# Altium project EMFI.PrjPcb
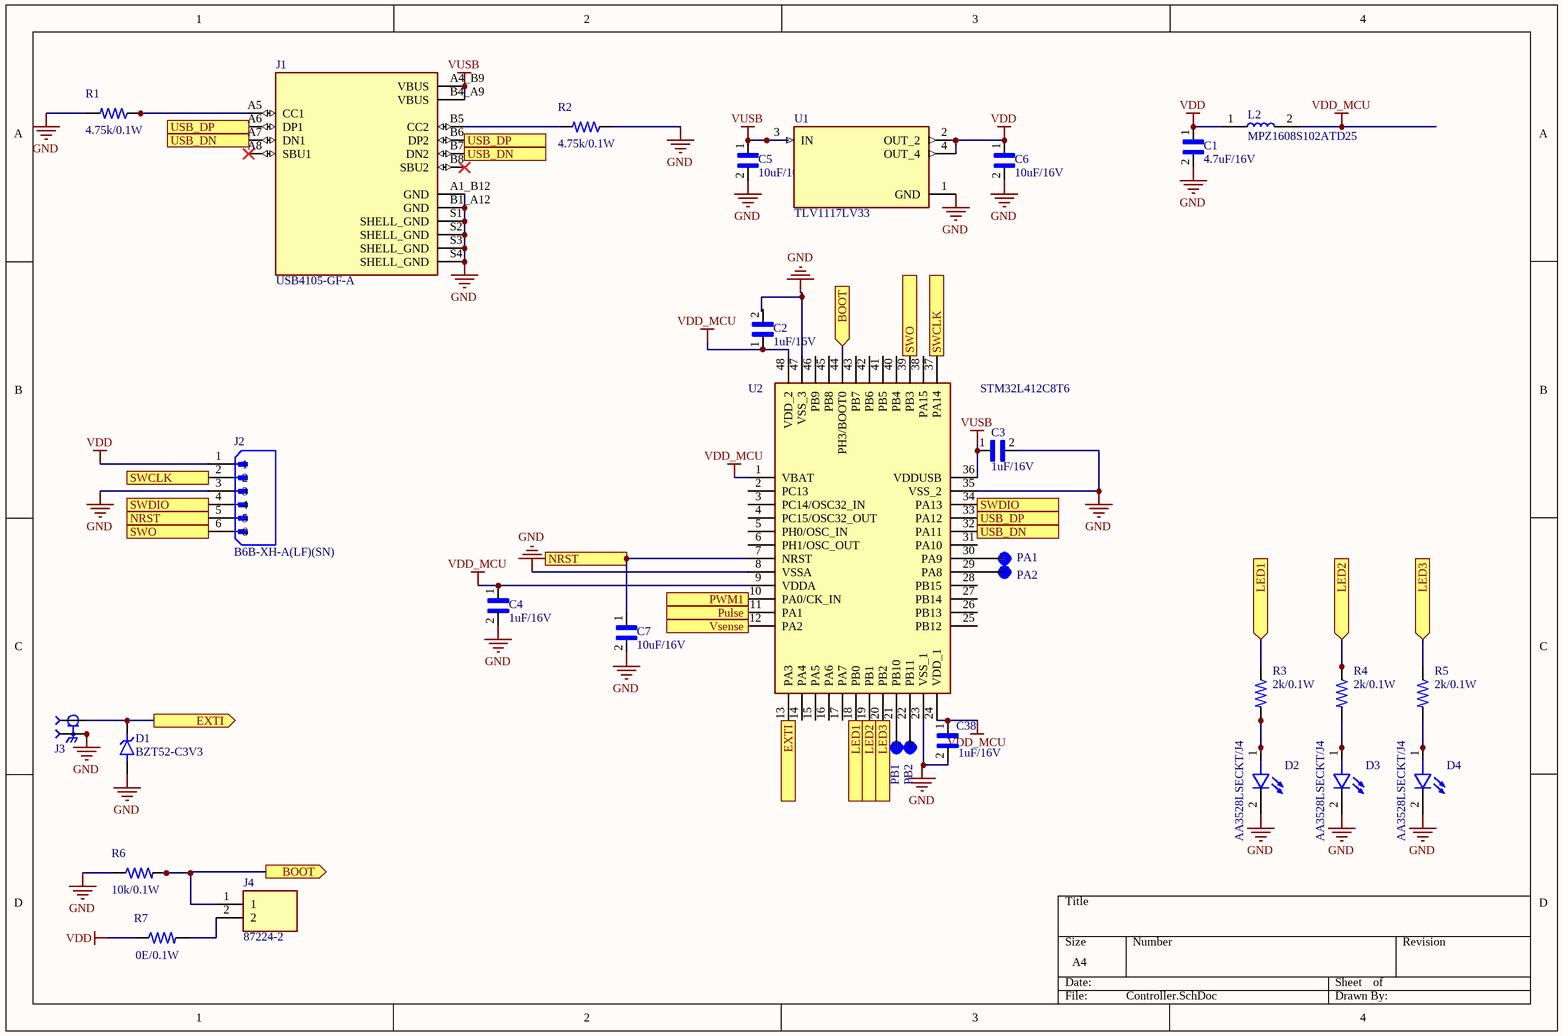
[diagram p0: Controller.SchDoc]
2 sheets, 90 parts. Net scope: flat (ports and power ports of the same name join across sheets).
Board file: EMFI.PcbDoc
Sheets:
  Controller.SchDoc
  Power.SchDoc

## Sheet Controller.SchDoc
size A4; SheetNumber: 1; SheetTotal: 2

### Parts
C1  4.7uF/16V  [CAPC1608X90]
C2  1uF/16V  [CAPC1608X90]
C3  1uF/16V  [CAPC1608X90]
C4  1uF/16V  [CAPC1608X90]
C5  10uF/16V  [CAPC1608X90]
C6  10uF/16V  [CAPC1608X90]
C7  10uF/16V  [CAPC1608X90]
C38  1uF/16V  [CAPC1608X90]
D1  BZT52-C3V3  [SOD3715X145N]
D2  AA3528LSECKT/J4  [LED_OF-SMD3528WC]
D3  AA3528LSECKT/J4  [LED_OF-SMD3528WC]
D4  AA3528LSECKT/J4  [LED_OF-SMD3528WC]
J1  USB4105-GF-A  [GCT_USB4105-GF-A]
J2  B6B-XH-A(LF)(SN)  [JST_B6B-XH-A(LF)(SN)]
J3  SMA-J-P-X-ST-EM3  [SAMTEC_SMA-J-P-X-ST-EM3]  (value not drawn)
J4  87224-2  [TE_87224-2]
L2  MPZ1608S102ATD25  [INDC1608X95N]
PA1  5019  [KEYSTONE_5019]  (value not drawn)
PA2  5019  [KEYSTONE_5019]  (value not drawn)
PB1  5019  [KEYSTONE_5019]  (value not drawn)
PB2  5019  [KEYSTONE_5019]  (value not drawn)
R1  4.75k/0.1W  [RESC1608X50N]
R2  4.75k/0.1W  [RESC1608X50N]
R3  2k/0.1W  [RESC1608X50N]
R4  2k/0.1W  [RESC1608X50N]
R5  2k/0.1W  [RESC1608X50N]
R6  10k/0.1W  [RESC1608X50N]
R7  0E/0.1W  [RESC1608X50N]
U1  TLV1117LV33  [VREG_TLV1117LV33DCYR]
U2  STM32L412C8T6  [QFP50P900X900X160-48N]

### Ports
BOOT (in, see Controller[1D]), BOOT (out, see Controller[3B]), EXTI (in, see Controller[1C], Power[1D]), EXTI (out, see Controller[3D], Power[1D]), LED1 (in, see Controller[3D]), LED1 (out, see Controller[4C]), LED2 (in, see Controller[3D]), LED2 (out, see Controller[4C]), LED3 (in, see Controller[3D]), LED3 (out, see Controller[4C]), NRST (see Controller[1C]), NRST (see Controller[2C]), Pulse (out, see Power[1D]), PWM1 (out, see Power[1B]), SWCLK (see Controller[1B]), SWCLK (see Controller[3B]), SWDIO (see Controller[1B]), SWDIO (see Controller[3B]), SWO (see Controller[1C]), SWO (see Controller[3B]), USB_DN (see Controller[1A], Controller[2A]), USB_DN (see Controller[1A], Controller[3C]), USB_DN (see Controller[2A], Controller[3C]), USB_DP (see Controller[1A], Controller[2A]), USB_DP (see Controller[1A], Controller[3C]), USB_DP (see Controller[2A], Controller[3C]), Vsense (in, see Power[3C])

### Nets
GND: C1.2 C3.2 C4.2 C5.2 C6.2 C7.2 C38.2 D1.A D2.2(C) D3.2(C) D4.2(C) J1.A1_B12(GND) J1.B1_A12(GND) J1.S1(SHELL_GND) J1.S2(SHELL_GND) J1.S3(SHELL_GND) J1.S4(SHELL_GND) J2.3 J3.2 J3.3 R1.2 R2.1 R6.1 U1.1(GND) U2.8(VSSA) U2.23(VSS_1) U2.35(VSS_2) U2.47(VSS_3)
VDD: C1.1 C6.1 J2.1 L2.1 R7.1 U1.2(OUT_2) U1.4(OUT_4)
VDD_MCU: C2.1 C4.1 C38.1 L2.2 U2.1(VBAT) U2.9(VDDA) U2.24(VDD_1) U2.48(VDD_2)
VUSB: C3.1 C5.1 J1.A4_B9(VBUS) J1.B4_A9(VBUS) U1.3(IN) U2.36(VDDUSB)
NetC7_1: C7.1 J2.5 U2.7(NRST) ; port NRST
NetD1_C: D1.C J3.1 U2.13(PA3) ; port EXTI
NetD2_1: D2.1(A) R3.2
NetD3_1: D3.1(A) R4.2
NetD4_1: D4.1(A) R5.2
NetJ1_A5: J1.A5(CC1) R1.1
NetJ1_A6: J1.A6(DP1) J1.B6(DP2) U2.33(PA12) ; port USB_DP
NetJ1_A7: J1.A7(DN1) J1.B7(DN2) U2.32(PA11) ; port USB_DN
NetJ1_B5: J1.B5(CC2) R2.2
NetJ2_2: J2.2 U2.37(PA14) ; port SWCLK
NetJ2_4: J2.4 U2.34(PA13) ; port SWDIO
NetJ2_6: J2.6 U2.39(PB3) ; port SWO
NetJ4_1: J4.1 R6.2 U2.44(PH3/BOOT0) ; port BOOT
NetJ4_2: J4.2 R7.2
NetPA1_TP?: PA1.TP?(TP) U2.30(PA9)
NetPA2_TP?: PA2.TP?(TP) U2.29(PA8)
NetPB1_TP?: PB1.TP?(TP) U2.21(PB10)
NetPB2_TP?: PB2.TP?(TP) U2.22(PB11)
NetR3_1: R3.1 U2.18(PB0) ; port LED1
NetR4_1: R4.1 U2.19(PB1) ; port LED2
NetR5_1: R5.1 U2.20(PB2) ; port LED3
NetR10_1: U2.10(PA0/CK_IN) ; port PWM1
NetR11_2: U2.12(PA2) ; port Vsense
NetR16_2: U2.11(PA1) ; port Pulse

Not connected (* = marked no-connect by the designer): C2 2; J1 A8(SBU1)* B8(SBU2)*; U2 2(PC13) 3(PC14/OSC32_IN) 4(PC15/OSC32_OUT) 5(PH0/OSC_IN) 6(PH1/OSC_OUT) 14(PA4) 15(PA5) 16(PA6) 17(PA7) 25(PB12) 26(PB13) 27(PB14) 28(PB15) 31(PA10) 38(PA15) 40(PB4) 41(PB5) 42(PB6) 43(PB7) 45(PB8) 46(PB9)

### Library data of the parts
C1-C7 C38 = CC0603MRX5R7BB106: 0603; Package: None; Price: None; Value: *; MP: CC0603MRX5R7BB106; Availability: Unavailable
D1 = BZT52C3V9-7-F: SOD-123; MF: Diodes Inc.; Package: SOD-123 Diodes Inc.; MP: BZT52C3V9-7-F; Value: *; Availability: Unavailable; SnapEDA_Link: https://www.snapeda.com/parts/BZT52C3V9-7-F/Diodes%20Inc./view-part/270582/?ref=snap; Price: None
D2-D4 = OF-SMD3528WC: PLCC2; MF: Optoflash; Availability: Not in stock; SnapEDA_Link: https://www.snapeda.com/parts/OF-SMD3528WC/Optoflash/view-part/?ref=snap; MP: OF-SMD3528WC; Value: *; Price: None; Package: PLCC-2 Optoflash; Check_prices: https://www.snapeda.com/parts/OF-SMD3528WC/Optoflash/view-part/?ref=eda
J1 = USB4105-GF-A: USB-C (USB TYPE-C) USB 2.0 Receptacle Connector 24 (16+8 Dummy) Position Surface Mount, Right Angle; Through Hole; MF: GCT; Price: None; Availability: In Stock; MP: USB4105-GF-A; Package: None; SnapEDA_Link: https://www.snapeda.com/parts/USB4105-GF-A/Global+Connector+Technology/view-part/?ref=snap; Check_prices: https://www.snapeda.com/parts/USB4105-GF-A/Global+Connector+Technology/view-part/?ref=eda; Value: *; Purchase-URL: https://pricing.snapeda.com/search/part/USB4105-GF-A/?ref=eda
J2 = B6B-XH-A(LF)(SN): Connector Header Through Hole 6 position 0.098 (2.50mm); MF: JST Sales; MP: B6B-XH-A(LF)(SN); SnapEDA_Link: https://www.snapeda.com/parts/B6B-XH-A(LF)(SN)/JST+Sales+America+Inc./view-part/?ref=snap; Price: None; Check_prices: https://www.snapeda.com/parts/B6B-XH-A(LF)(SN)/JST+Sales+America+Inc./view-part/?ref=eda; Availability: In Stock; Package: None; Purchase-URL: https://pricing.snapeda.com/search/part/B6B-XH-A(LF)(SN)/?ref=eda; Value: *
J3 = SMA-J-P-X-ST-EM3: RF Connectors / Coaxial Connectors; MF: Samtec; Price: None; Package: None; Availability: Unavailable; Value: *; MP: SMA-J-P-X-ST-EM3
J4 = 87224-2: Connector Unshrouded Header HDR 2 Position 2.54mm Solder Straight Thru-Hole; MF: TE Connectivity; Number_of_Positions: 2; Centerline_Pitch: 2.54 mm[.1 in]; Value: *; EU_RoHS_Compliance: Compliant; SnapEDA_Link: https://www.snapeda.com/parts/87224-2/TE%20Connectivity%20AMP%20Connectors/view-part/494877/?ref=snap; Price: None; Availability: Unavailable; TE_purchase_URL: https://www.te.com/usa-en/product-87224-2.html?te_bu=Cor&te_type=disp&te_campaign=seda_glo_cor-seda-global-disp-prtnr-fy19-seda-model-bom-cta_sma-317_1&elqCampaignId=32493; Package: None; Product_Type: Connector; MP: 87224-2
L2 = MMZ1608Y150B: 0603; Package: None; Price: None; Value: *; MP: MMZ1608Y150B; Availability: Unavailable
PA1 PA2 PB1 PB2 = 5019: SMT Test Point- Mininature-1000 pc Reels; MF: Keystone Electronics; Value: *; MP: 5019; Availability: In Stock; Purchase-URL: https://pricing.snapeda.com/search/part/5019/?ref=eda; Package: None; Price: None
R1-R7 = 3-1879460-5: RES 0.27 OHM 1% 1/10W 0603; MF: TE Connectivity; Power_Rating: .1 W; Resistance: 27; Value: *; Check_prices: https://www.snapeda.com/parts/3-1879460-5/TE+Connectivity/view-part/?ref=eda; Availability: In Stock; Package: 0603; Tolerance: 1%; SnapEDA_Link: https://www.snapeda.com/parts/3-1879460-5/TE+Connectivity/view-part/?ref=snap; Price: None; EU_RoHS_Compliance: Compliant with Exemptions; MP: 3-1879460-5
U1 = TLV1117LV33DCYR: 1-A, low-dropout voltage regulator; MF: Texas Instruments; Check_prices: https://www.snapeda.com/parts/TLV1117LV33DCYR/Texas+Instruments/view-part/?ref=eda; Value: *; MP: TLV1117LV33DCYR; Purchase-URL: https://pricing.snapeda.com/search/part/TLV1117LV33DCYR/?ref=eda; SnapEDA_Link: https://www.snapeda.com/parts/TLV1117LV33DCYR/Texas+Instruments/view-part/?ref=snap; Package: SOT-223-4 Texas Instruments; Digi-Key_Part_Number: 296-28778-2-ND
U2 = STM32L412C8T6: STMICROELECTRONICS - STM32L412C8T6 - MCU, 32BIT, 80MHZ; Geometry.Height: 1.6mm; Arrow Part Number: STM32L412C8T6; Arrow Price/Stock: https://www.arrow.com/en/products/stm32l412c8t6/stmicroelectronics?region=nac; Manufacturer_Name: STMicroelectronics; Manufacturer_Part_Number: STM32L412C8T6; Datasheet Link: https://www.arrow.com/en/products/stm32l412c8t6/stmicroelectronics?region=nac

## Sheet Power.SchDoc
size A4; SheetNumber: 2; SheetTotal: 2
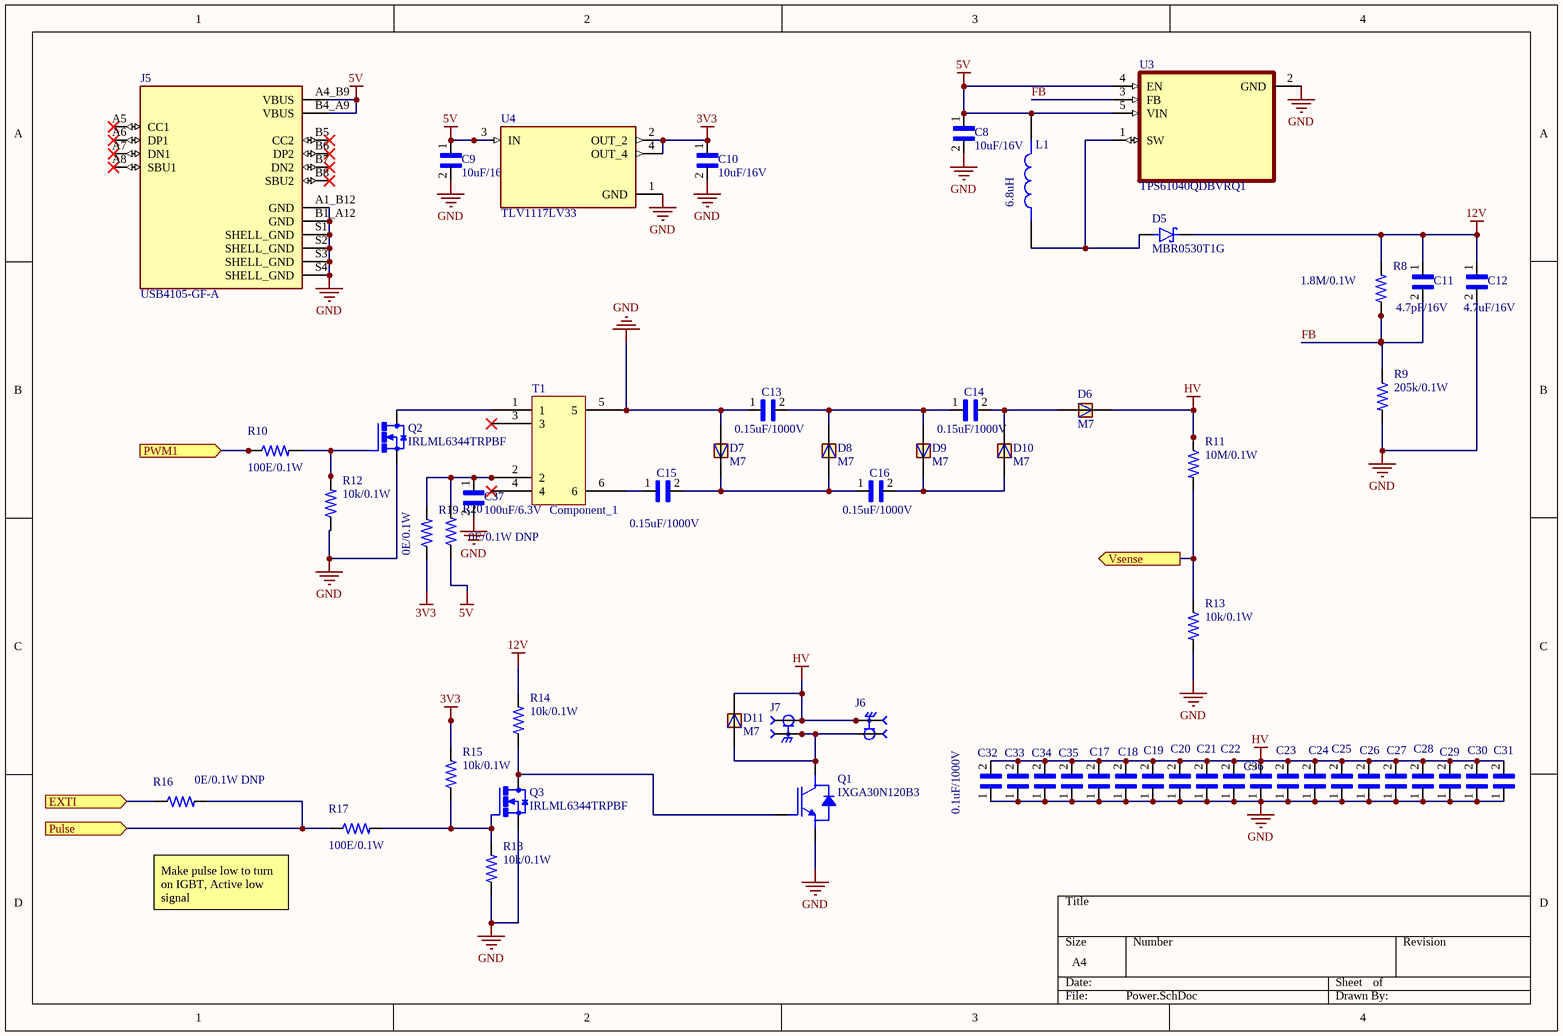
[diagram p1: Power.SchDoc]

### Parts
C8  10uF/16V  [CAPC1608X90]
C9  10uF/16V  [CAPC1608X90]
C10  10uF/16V  [CAPC1608X90]
C11  4.7pF/16V  [CAPC1608X90]
C12  4.7uF/16V  [CAPC1608X90]
C13  0.15uF/1000V  [CAPC5563X218N]
C14  0.15uF/1000V  [CAPC5563X218N]
C15  0.15uF/1000V  [CAPC5563X218N]
C16  0.15uF/1000V  [CAPC5563X218N]
C17  0.1uF/1000V  [CAPC4632X221N]  (value not drawn)
C18  0.1uF/1000V  [CAPC4632X221N]  (value not drawn)
C19  0.1uF/1000V  [CAPC4632X221N]  (value not drawn)
C20  0.1uF/1000V  [CAPC4632X221N]  (value not drawn)
C21  0.1uF/1000V  [CAPC4632X221N]  (value not drawn)
C22  0.1uF/1000V  [CAPC4632X221N]  (value not drawn)
C23  0.1uF/1000V  [CAPC4632X221N]  (value not drawn)
C24  0.1uF/1000V  [CAPC4632X221N]  (value not drawn)
C25  0.1uF/1000V  [CAPC4632X221N]  (value not drawn)
C26  0.1uF/1000V  [CAPC4632X221N]  (value not drawn)
C27  0.1uF/1000V  [CAPC4632X221N]  (value not drawn)
C28  0.1uF/1000V  [CAPC4632X221N]  (value not drawn)
C29  0.1uF/1000V  [CAPC4632X221N]  (value not drawn)
C30  0.1uF/1000V  [CAPC4632X221N]  (value not drawn)
C31  0.1uF/1000V  [CAPC4632X221N]  (value not drawn)
C32  0.1uF/1000V  [CAPC4632X221N]
C33  0.1uF/1000V  [CAPC4632X221N]  (value not drawn)
C34  0.1uF/1000V  [CAPC4632X221N]  (value not drawn)
C35  0.1uF/1000V  [CAPC4632X221N]  (value not drawn)
C36  0.1uF/1000V  [CAPC4632X221N]  (value not drawn)
C37  100uF/6.3V  [CAPC1608X90]
D5  MBR0530T1G  [SOD3715X145N]
D6  M7  [DIOM505270X240]
D7  M7  [DIOM505270X240]
D8  M7  [DIOM505270X240]
D9  M7  [DIOM505270X240]
D10  M7  [DIOM505270X240]
D11  M7  [DIOM505270X240]
J5  USB4105-GF-A  [GCT_USB4105-GF-A]
J6  SMA-J-P-X-ST-EM3  [SAMTEC_SMA-J-P-X-ST-EM3]  (value not drawn)
J7  SMA-J-P-X-ST-EM3  [SAMTEC_SMA-J-P-X-ST-EM3]  (value not drawn)
L1  6.8uH  [INDM3225X240N]
Q1  IXGA30N120B3  [TO254P1524X483-3N]
Q2  IRLML6344TRPBF  [SOT23]
Q3  IRLML6344TRPBF  [SOT23]
R8  1.8M/0.1W  [RESC1608X50N]
R9  205k/0.1W  [RESC1608X50N]
R10  100E/0.1W  [RESC1608X50N]
R11  10M/0.1W  [RESC1608X50N]
R12  10k/0.1W  [RESC1608X50N]
R13  10k/0.1W  [RESC1608X50N]
R14  10k/0.1W  [RESC1608X50N]
R15  10k/0.1W  [RESC1608X50N]
R16  0E/0.1W DNP  [RESC1608X50N]
R17  100E/0.1W  [RESC1608X50N]
R18  10k/0.1W  [RESC1608X50N]
R19  0E/0.1W  [RESC1608X50N]
R20  0E/0.1W DNP  [RESC1608X50N]
T1  Component_1  [PCBComponent_1]
U3  TPS61040QDBVRQ1  [SOT95P280X145-5N]
U4  TLV1117LV33  [VREG_TLV1117LV33DCYR]

### Ports
EXTI (in, see Controller[1C], Controller[3D]), Pulse (in, see Controller[2C]), PWM1 (in, see Controller[2C]), Vsense (out, see Controller[2C])

### Nets
3V3: C10.1 R15.2 R19.1 U4.2(OUT_2) U4.4(OUT_4)
5V: C8.1 C9.1 J5.A4_B9(VBUS) J5.B4_A9(VBUS) L1.2 R20.1 U3.4(EN) U3.5(VIN) U4.3(IN)
12V: C11.1 C12.1 D5.1(K) R8.2 R14.2
GND: C8.2 C9.2 C10.2 C12.2 C13.1 C17.1 C18.1 C19.1 C20.1 C21.1 C22.1 C23.1 C24.1 C25.1 C26.1 C27.1 C28.1 C29.1 C30.1 C31.1 C32.1 C33.1 C34.1 C35.1 C36.1 C37.2 D7.A J5.A1_B12(GND) J5.B1_A12(GND) J5.S1(SHELL_GND) J5.S2(SHELL_GND) J5.S3(SHELL_GND) J5.S4(SHELL_GND) Q1.3(E) Q2.2(S) Q3.2(S) R9.2 R12.1 R13.2 R18.1 T1.5 U3.2(GND) U4.1(GND)
HV: C17.2 C18.2 C19.2 C20.2 C21.2 C22.2 C23.2 C24.2 C25.2 C26.2 C27.2 C28.2 C29.2 C30.2 C31.2 C32.2 C33.2 C34.2 C35.2 C36.2 D6.C D11.C J6.2 J6.3 J7.1 R11.1
FB: C11.2 R8.1 R9.1 U3.3(FB)
NetC13_2: C13.2 C14.1 D8.C D9.A
NetC14_2: C14.2 D6.A D10.C
NetC15_1: C15.1 T1.6
NetC15_2: C15.2 C16.1 D7.C D8.A
NetC16_2: C16.2 D9.C D10.A
NetC37_1: C37.1 R19.2 R20.2 T1.2
NetD1_C: R16.1 ; port EXTI
NetD5_2: D5.2(A) L1.1 U3.1(SW)
NetD11_A: D11.A J6.1 J7.2 J7.3 Q1.2(C)
NetQ1_1: Q1.1(G) Q3.3(D) R14.1
NetQ2_1: Q2.1(G) R10.2 R12.2
NetQ2_3: Q2.3(D) T1.1
NetQ3_1: Q3.1(G) R15.1 R17.2 R18.2
NetR10_1: R10.1 ; port PWM1
NetR11_2: R11.2 R13.1 ; port Vsense
NetR16_2: R16.2 R17.1 ; port Pulse

Not connected (* = marked no-connect by the designer): J5 A5(CC1)* A6(DP1)* A7(DN1)* A8(SBU1)* B5(CC2)* B6(DP2)* B7(DN2)* B8(SBU2)*; T1 3* 4*

### Notes on the sheet
- Make pulse low to turn on IGBT, Active low signal

### Library data of the parts
C8-C12 C37 = CC0603MRX5R7BB106: CAP CER 10UF 16V X5R 0603; Package: None; Price: None; Value: *; MP: CC0603MRX5R7BB106; Availability: Unavailable
C13-C16 = VJ2225Y104KBGAT4X: Package: None; Price: None; Value: *; MP: VJ2225Y104KBGAT4X; Availability: Unavailable
C17-C36 = 1812CC104KAZ1A: 1812; MF: AVX; MP: 1812CC104KAZ1A; SnapEDA_Link: https://www.snapeda.com/parts/1812CC104KAZ1A/AVX/view-part/?ref=snap; Availability: In Stock; Package: 4632 AVX; Check_prices: https://www.snapeda.com/parts/1812CC104KAZ1A/AVX/view-part/?ref=eda; Value: *; Purchase-URL: https://pricing.snapeda.com/search/part/1812CC104KAZ1A/?ref=eda; Price: None
D5 = BAT46W-7-F: SOD-123; MF: Diodes Inc.; Package: SOD-123 Fairchild Semiconductor; Availability: In Stock; SnapEDA_Link: https://www.snapeda.com/parts/BAT46W-7-F/Diodes+Inc./view-part/?ref=snap; MP: BAT46W-7-F; Price: None; Check_prices: https://www.snapeda.com/parts/BAT46W-7-F/Diodes+Inc./view-part/?ref=eda; Value: *; Purchase-URL: https://pricing.snapeda.com/search/part/BAT46W-7-F/?ref=eda
D6-D11 = M7: Diode Standard 1000 V 1A Surface Mount DO-214AC (SMA); MF: Diotec Semiconductor; Price: None; Package: DO-214AC-2 Diotec; Purchase-URL: https://pricing.snapeda.com/search/part/M7/?ref=eda; Availability: In Stock; SnapEDA_Link: https://www.snapeda.com/parts/M7/Diotec/view-part/?ref=snap; Value: *; MP: M7; Check_prices: https://www.snapeda.com/parts/M7/Diotec/view-part/?ref=eda
J5 = USB4105-GF-A: as J1 on sheet Controller; Price: None; Availability: In Stock; MP: USB4105-GF-A; Package: None; SnapEDA_Link: https://www.snapeda.com/parts/USB4105-GF-A/Global+Connector+Technology/view-part/?ref=snap; Check_prices: https://www.snapeda.com/parts/USB4105-GF-A/Global+Connector+Technology/view-part/?ref=eda; Value: *; Purchase-URL: https://pricing.snapeda.com/search/part/USB4105-GF-A/?ref=eda
J6 J7 = SMA-J-P-X-ST-EM3: as J3 on sheet Controller; Price: None; Package: None; Availability: Unavailable; Value: *; MP: SMA-J-P-X-ST-EM3
L1 = NLCV32T-6R8M-EFR: 1210; MF: TDK; Digi-Key_Part_Number: 445-16406-2-ND; Package: SMD-2 TDK; SnapEDA_Link: https://www.snapeda.com/parts/NLCV32T-6R8M-EFR/TDK/view-part/?ref=snap; Value: *; MP: NLCV32T-6R8M-EFR; Check_prices: https://www.snapeda.com/parts/NLCV32T-6R8M-EFR/TDK/view-part/?ref=eda; Purchase-URL: https://pricing.snapeda.com/search/part/NLCV32T-6R8M-EFR/?ref=eda
Q1 = ISL9V5045S3ST: TO-263-3; Package: None; Price: None; Value: *; MP: ISL9V5045S3ST; Availability: Unavailable
Q2 Q3 = MMBF170: SOT-23-3; MF: ON Semiconductor; Availability: Unavailable; Package: SOT-23 ON Semiconductor; SnapEDA_Link: https://www.snapeda.com/parts/MMBF170/ON%20Semiconductor/view-part/1400962/?ref=snap; MP: MMBF170; Price: None; Value: *
R8-R20 = 3-1879460-5: as R1 on sheet Controller; Value: *; Check_prices: https://www.snapeda.com/parts/3-1879460-5/TE+Connectivity/view-part/?ref=eda; Availability: In Stock; Package: 0603; Tolerance: 1%; SnapEDA_Link: https://www.snapeda.com/parts/3-1879460-5/TE+Connectivity/view-part/?ref=snap; Price: None; EU_RoHS_Compliance: Compliant with Exemptions; MP: 3-1879460-5
U4 = TLV1117LV33DCYR: as U1 on sheet Controller; Check_prices: https://www.snapeda.com/parts/TLV1117LV33DCYR/Texas+Instruments/view-part/?ref=eda; Value: *; MP: TLV1117LV33DCYR; Purchase-URL: https://pricing.snapeda.com/search/part/TLV1117LV33DCYR/?ref=eda; SnapEDA_Link: https://www.snapeda.com/parts/TLV1117LV33DCYR/Texas+Instruments/view-part/?ref=snap; Package: SOT-223-4 Texas Instruments; Digi-Key_Part_Number: 296-28778-2-ND
U3 = TPS61040QDBVRQ1: Package: None; Price: None; Value: *; MP: TPS61040QDBVRQ1; Availability: Unavailable

## Nets that join several sheets
GND: Controller (28 pins), Power (43 pins)
NetD1_C: Controller (D1.C J3.1 U2.13), Power (R16.1)
NetR10_1: Controller (U2.10), Power (R10.1)
NetR11_2: Controller (U2.12), Power (R11.2 R13.1)
NetR16_2: Controller (U2.11), Power (R16.2 R17.1)